# Altium schematic sheet 3_BackBone.SchDoc
size A3; DocumentNumber: 4; SheetNumber: 4; SheetTotal: 6
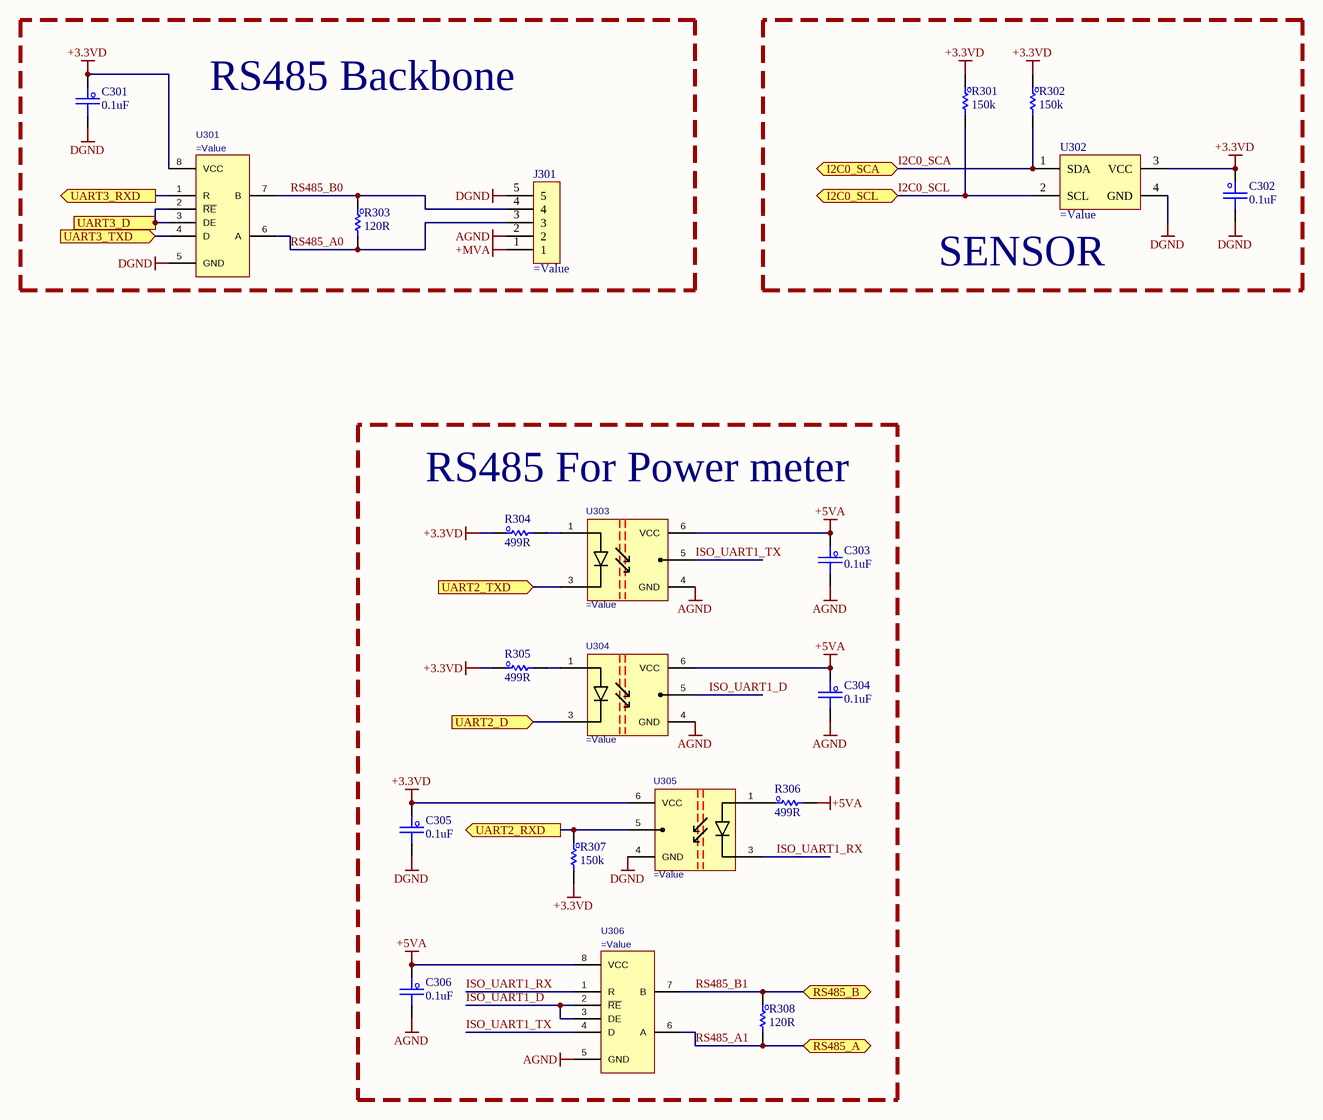
[diagram p0: 3_BackBone.SchDoc]

## Parts
C301  0.1uF  [C_0603]  (no BOM)
C302  0.1uF  [C_0603]
C303  0.1uF  [C_0603]
C304  0.1uF  [C_0603]
C305  0.1uF  [C_0603]
C306  0.1uF  [C_0603]
J301  (no value)  [CON_9155005541006]  (no BOM)
R301  150k  [R_0603]
R302  150k  [R_0603]
R303  120R  [R_0603]  (no BOM)
R304  499R  [R_0603]
R305  499R  [R_0603]
R306  499R  [R_0603]
R307  150k  [R_0603]
R308  120R  [R_0603]
U301  (no value)  [D0008A_L]  (no BOM)
U302  (no value)  [XDCR_SHT40-AD1B-R2]
U303  (no value)  [5PIN SO6_TOS]
U304  (no value)  [5PIN SO6_TOS]
U305  (no value)  [5PIN SO6_TOS]
U306  (no value)  [D0008A_L]

## Blocks framed on the sheet
RS485 Backbone: C301 J301 R303 U301
SENSOR: C302 R301 R302 U302
RS485 For Power meter: C303-C306 R304-R308 U303-U306

## Ports
I2C0_SCA (bidir), I2C0_SCL (bidir), RS485_A (bidir), RS485_B (bidir), UART2_D (in), UART2_RXD (out), UART2_TXD (in), UART3_D (in), UART3_RXD (out), UART3_TXD (in)

## Nets
+3.3VD: C301.1 C302.1 C305.1 R301.1 R302.1 R304.1 R305.1 R307.2 U301.8(VCC) U302.3(VCC) U305.6(VCC)
+5VA: C303.1 C304.1 C306.1 R306.2 U303.6(VCC) U304.6(VCC) U306.8(VCC)
+MVA: J301.1
AGND: C303.2 C304.2 C306.2 J301.2 U303.4(GND) U304.4(GND) U306.5(GND)
DGND: C301.2 C302.2 C305.2 J301.5 U301.5(GND) U302.4(GND) U305.4(GND)
I2C0_SCA: R302.2 U302.1(SDA) ; port I2C0_SCA
I2C0_SCL: R301.2 U302.2(SCL) ; port I2C0_SCL
ISO_UART1_D: U304.5(O1) U306.2(~{RE}) U306.3(DE)
ISO_UART1_RX: U305.3(A) U306.1(R)
ISO_UART1_TX: U303.5(O1) U306.4(D)
RS485_A0: J301.3 R303.2 U301.6(A)
RS485_A1: R308.2 U306.6(A) ; port RS485_A
RS485_B0: J301.4 R303.1 U301.7(B)
RS485_B1: R308.1 U306.7(B) ; port RS485_B
UART2_D: U304.3(A) ; port UART2_D
UART2_RXD: R307.1 U305.5(O1) ; port UART2_RXD
UART2_TXD: U303.3(A) ; port UART2_TXD
UART3_D: U301.2(~{RE}) U301.3(DE) ; port UART3_D
UART3_RXD: U301.1(R) ; port UART3_RXD
UART3_TXD: U301.4(D) ; port UART3_TXD
NetR304_2: R304.2 U303.1(A)
NetR305_2: R305.2 U304.1(A)
NetR306_1: R306.1 U305.1(A)

## Notes on the sheet
- Title :
- Revision :
- ผู้จัดทำ:
- Size:
- A3
- Time:
- ผู้เขียน:
- บริษัท ยูนิเวอร์แซล ยูทีลิตี้ส์ จำกัด (มหาชน) เลขที่ 1 อาคาร อีสท์วอเตอร์ ชั้น 18 ซอยวิภาวดีรังสิต 5 แขวงจอมพล เขตจตุจักร กรุงเทพฯ 10900
  Tel : +662-272-1688
  Fax :+662-2721690-1
- -
- Sheet:
- of
- ผู้อำนวยการ
- ผู้ตรวจสอบ:
- Number:
- กรรมการผู้จัดการ:
- File:

## Library data of the parts
C301-C306 = C_Capacitor: CAP CER 0.1UF 50V X7R 0603; Manufacturer: KEMET; PartNumber: C0603C104K5RACTU; PackageReference: 0603; PartID: 399-5089-1-ND; Value2: 50V; Value: 0.1uF; Value3: *
J301 = CON_5P_9155005541006: CONN SPRING BATTERY 5POS R/A SMD; PartNumber: 009155005541006; Manufacturer: AVX; Value: 009155005541006; PartID: 478-5453-1-ND; PackageReference: *; Value2: *; Value3: *
R301 R302 R307 = R_Resister: RES SMD 150K OHM 1% 1/10W 0603; Manufacturer: Vishay Dale; PartNumber: CRCW0603150KFKEAC; Value2: 0.1W; Value: 150k; PackageReference: 0603; PartID: 541-4034-1-ND; Value3: *
R303 R308 = R_Resister: RES SMD 120 OHM 1% 1/3W 0603; Manufacturer: Vishay Dale; PartNumber: CRCW0603120RFKEAHP; Value2: 0.333W; Value: 120R; PackageReference: 0603; PartID: 541-120SCT-ND; Value3: *
R304-R306 = R_Resister: RES 499 OHM 1% 1/10W 0603; Manufacturer: Vishay Dale; PartNumber: CRCW0603499RFKEAC; Value2: 0.1W; Value: 499R; PackageReference: 0603; PartID: 541-3986-1-ND; Value3: *
U301 = IC_TRAN_THVD1505DR: IC TRANSCEIVER HALF 1/1 8SOIC; Manufacturer: Texas Instruments; PartNumber: SN65HVD11DR; Value: SN65HVD11DR; Value3: SN65HVD1780QDRQ1; PackageReference: 8SOIC; PartID: 0086-0766-1; Value2: SN65HVD11DR
U302 = IC_SEN_SHT40-AD1B-R3: SENSOR HUMIDITY 100 RH SMD; Manufacturer: Sensirion AG; PartNumber: SHT40-AD1B-R3; PartID: 1649-SHT40-AD1B-R3CT-ND; PackageReference: QFN-4; Value: SHT40-AD1B-R3; Value2: *; Value3: *
U303-U305 = IC_OPTO_TLP109(TPR,E): OPTOISO 5KV PUSH PULL SO6L; Manufacturer: Toshiba Semiconductor and Storage; Value: TLP2362(TPL,E(T; PackageReference: SO-6; PartID: C37658; PartNumber: TLP2362(TPL,E(T; Value2: TLP2362(TPL,E(T; Value3: TLP109(TPR,E)
U306 = IC_TRAN_THVD1505DR: IC TRANSCEIVER HALF 1/1 8SOIC; Manufacturer: Texas Instruments; PartNumber: SN75176BDR; Value: SN75176BDR; Value3: SN65HVD1780QDRQ1; PackageReference: 8SOIC; PartID: 0086-0274-6